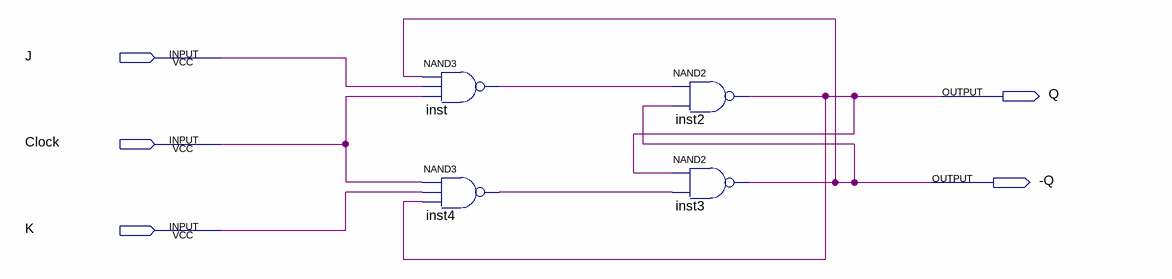
[diagram p0: schematic sheet]
// Quartus schematic JK.bdf as structural Verilog: 4 symbols, 5 pins
module JK (
  input  J,
  input  Clock,
  input  K,
  output Q,
  output \-Q 
);

  wire inst4_out, inst_out;

  nand inst (inst_out, \-Q , J, Clock);
  nand inst4 (inst4_out, Clock, K, Q);
  nand inst2 (Q, inst_out, \-Q );
  nand inst3 (\-Q , Q, inst4_out);
endmodule
